# EAGLE design damp (EAGLE 7.1.0)
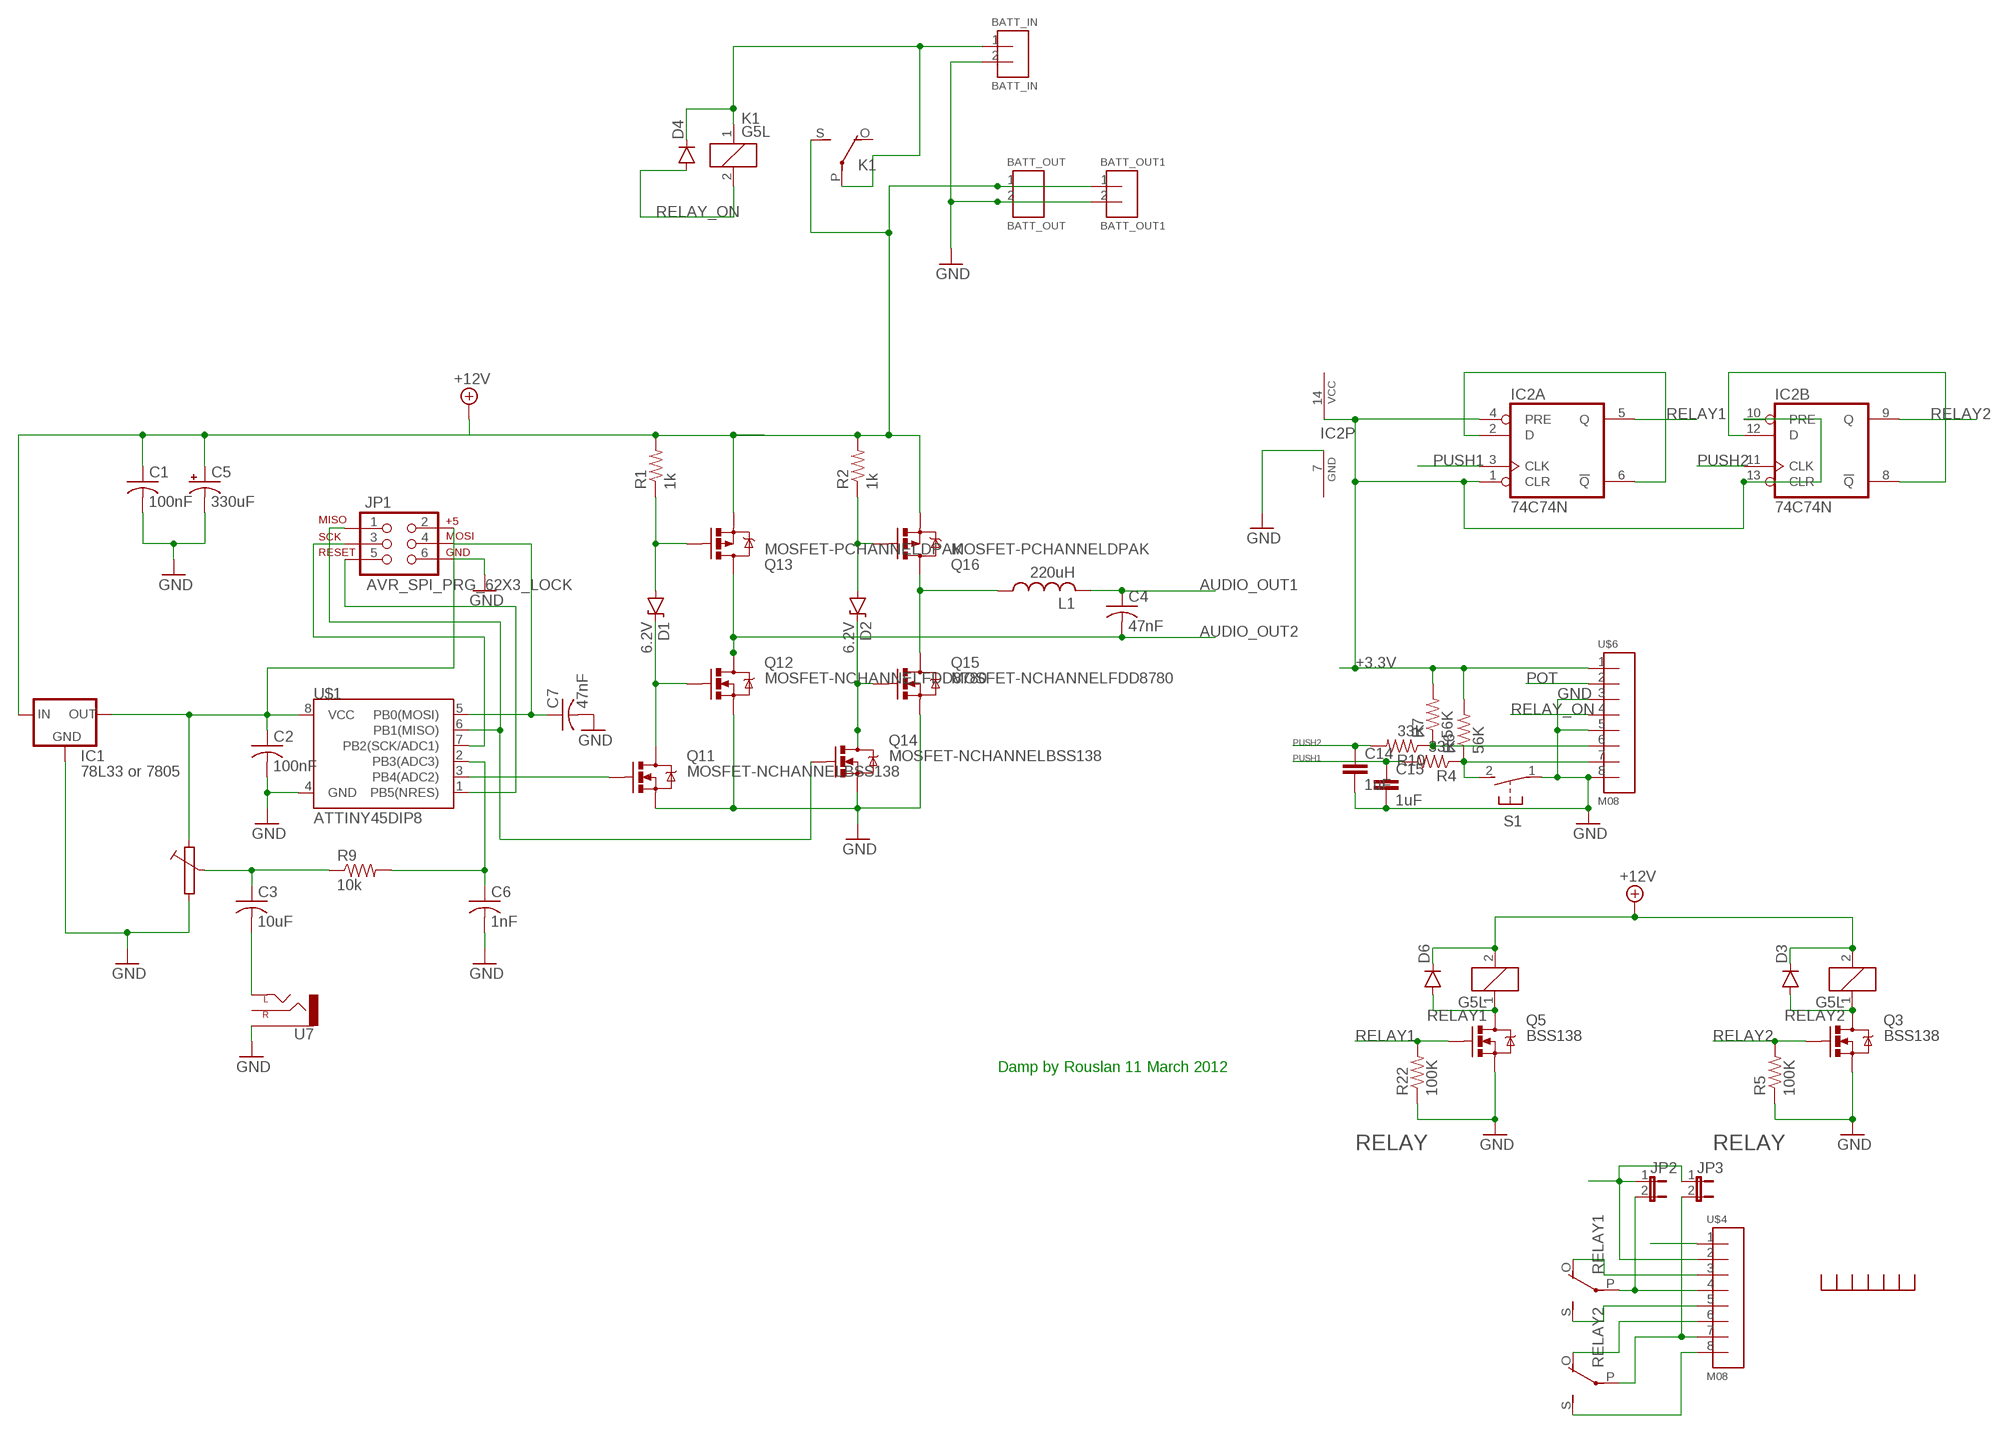
[diagram p0: schematic, sheet 1]

## Parts
BATT_IN  BATT_IN  M02PLUG  [PLUG_02]
BATT_OUT  BATT_OUT  M02PLUG  [PLUG_02]
BATT_OUT1  BATT_OUT1  M02PLUG  [PLUG_02]
C1  100nF  C-USC0603  [C0603]
C2  100nF  C-USC0603  [C0603]
C3  10uF  C-USC1206  [C1206]
C4  47nF  C-USC0603  [C0603]
C5  330uF  CPOL-USTT6D6  [TT5D6]
C6  1nF  C-USC0603  [C0603]
C7  47nF  C-USC0603  [C0603]
C14  1uF  C-EUC0603  [C0603]
C15  1uF  C-EUC0603  [C0603]
D1  6.2V  DIODE-ZENER3.3V  [SOD-323]
D2  6.2V  DIODE-ZENER3.3V  [SOD-323]
D3  DIODESMA-ALT  [SMA-DIODE_ALT]
D4  DIODESMA-ALT  [SMA-DIODE_ALT]
D6  DIODESMA-ALT  [SMA-DIODE_ALT]
IC1  78L33 or 7805  V_REG_78XXTO-92  [TO-92]
IC2  74C74N  74LS74N  [DIL14]
JP1  AVR_SPI_PRG_62X3_LOCK  [2X3_LOCK]
JP2  JP1E  [JP1]
JP3  JP1E  [JP1]
K1  G5L  [G5LE]
L1  220uH  L-USPIS2816  [PIS2816]
Q3  BSS138  MOSFET-NCHANNELBSS138  [SOT23-3]
Q5  BSS138  MOSFET-NCHANNELBSS138  [SOT23-3]
Q11  MOSFET-NCHANNELBSS138  [SOT23-3]
Q12  MOSFET-NCHANNELFDD8780  [DPAK]
Q13  MOSFET-PCHANNELDPAK  [DPAK]
Q14  MOSFET-NCHANNELBSS138  [SOT23-3]
Q15  MOSFET-NCHANNELFDD8780  [DPAK]
Q16  MOSFET-PCHANNELDPAK  [DPAK]
R1  1k  R-US_R0603  [R0603]
R2  1k  R-US_R0603  [R0603]
R4  33K  RESISTOR0603-RES  [0603-RES]
R5  100K  RESISTOR0603-RES  [0603-RES]
R6  56K  RESISTOR0603-RES  [0603-RES]
R7  56K  RESISTOR0603-RES  [0603-RES]
R9  10k  R-US_R0603  [R0603]
R10  33K  RESISTOR0603-RES  [0603-RES]
R22  100K  RESISTOR0603-RES  [0603-RES]
RELAY1  G5L  [G5LE]
RELAY2  G5L  [G5LE]
S1  31-XX  [B3F-31XX]
U7  AUDIO-JACKPTH  [AUDIO-JACK]
U$1  ATTINY45DIP8  [DIP08]
U$4  M08  [PLUG_08]
U$5  RADIATEUR  [RADIATEUR_577102B00000G]
U$6  M08  [PLUG_08]

## Nets
+3.3V: C2.1 IC1.3(OUT) IC2.1(A:CLR) IC2.4(A:PRE) IC2.10(B:PRE) IC2.13(B:CLR) JP1.2 R6.2 R7.2 U$1.8(VCC) U$6.1
+12V [5V]: BATT_OUT1.1 BATT_OUT.1 C1.1 C5.+ D3.C D6.C IC1.2(IN) K1.S(2:S) Q13.3(S) Q16.3(S) R1.2 R2.2 RELAY1.2 RELAY2.2
AUDIO_1: L1.1 Q15.4(D) Q16.4(D)
AUDIO_OUT1: C4.1 JP2.1 JP3.1 L1.2 U$4.2
AUDIO_OUT2: C4.2 Q12.4(D) Q13.4(D) U$4.1
GND: BATT_IN.2 BATT_OUT1.2 BATT_OUT.2 C1.2 C2.2 C5.- C6.2 C7.2 C14.2 C15.2 IC1.1(GND) JP1.6 Q3.2(S) Q5.2(S) Q11.2(S) Q12.3(S) Q14.2(S) Q15.3(S) R5.1 R22.1 S1.1(P) U7.SLEEVE U$1.4(GND) U$6.3 U$6.5 U$6.8
N$1: D1.A Q13.1(G) R1.1
N$2: D2.A Q16.1(G) R2.1
N$3: JP2.2 RELAY1.P(2:P) U$4.4
N$4: JP1.5 U$1.1(PB5(NRES))
N$7: D1.C Q11.3(D) Q12.1(G)
N$8: D2.C Q14.3(D) Q15.1(G)
N$10: C6.1 R9.2 U$1.2(PB3(ADC3))
N$11: C7.1 JP1.4 U$1.5(PB0(MOSI))
N$12: RELAY1.O(2:O) U$4.3
N$13: JP1.1 Q14.1(G) U$1.6(PB1(MISO))
N$14: JP1.3 U$1.7(PB2(SCK/ADC1))
N$15: RELAY1.S(2:S) U$4.5
N$16: RELAY2.O(2:O) U$4.6
N$17: RELAY2.S(2:S) U$4.8
N$18: Q11.1(G) U$1.3(PB4(ADC2))
N$19: D6.A Q5.3(D) RELAY1.1
N$20: R7.1 R10.1 U$6.6
N$21: JP3.2 RELAY2.P(2:P) U$4.7
N$22: R4.1 R6.1 S1.2(S) U$6.7
N$23: C3.2 U7.TIP(LEFT)
N$26: D3.A Q3.3(D) RELAY2.1
N$28: BATT_IN.1 D4.C K1.1 K1.P(2:P)
N$29: IC2.2(A:D) IC2.6(A:!Q)
N$32: IC2.8(B:!Q) IC2.12(B:D)
POT: C3.1 R9.1 U$6.2
PUSH1: C15.1 IC2.3(A:CLK) R4.2
PUSH2: C14.1 IC2.11(B:CLK) R10.2
RELAY1: IC2.5(A:Q) Q5.1(G) R22.2
RELAY2: IC2.9(B:Q) Q3.1(G) R5.2
RELAY_ON: D4.A K1.2 U$6.4
Unconnected: K1.O(2:O) U7.RING(RIGHT)

## Notes on the sheet
- Damp by Rouslan 11 March 2012
- RELAY | RELAY

## Power pins joined to a net without a drawn wire
GND: IC2.7(P:GND)
VCC: IC2.14(P:VCC)

## Library data of the parts
BATT_IN BATT_OUT BATT_OUT1 = pierre_vv:M02
C1-C4 C6 C7 = rcl:C-US: CAPACITOR, American symbol
C5 = rcl:CPOL-US: POLARIZED CAPACITOR, American symbol
C14 C15 = rcl:C-EU: CAPACITOR, European symbol
D1 D2 = SparkFun-DiscreteSemi:DIODE-ZENER: Zener Diode Production Part - 8199 3.4V Zener Voltage; PROD_ID: DIO-11284; VALUE: 3.3V
D3 D4 D6 = SparkFun-DiscreteSemi:DIODE: Diode These are standard reverse protection diodes and small signal diodes. SMA package can handle up to about 1A. SOD-323 can handle about 200mA. What the SOD-323 package when ordering, there are some mfgs out there that are 5-pin packages.
IC1 = SparkFun:V_REG_78XX: Voltage Regulator Standard 7805 5V regulator. IGO (Input Ground Output). Spark Fun Electronics SKU : COM-00107
IC2 = 74xx-us:74*74: Dual D type positive edge triggered FLIP FLOP, preset and clear
JP1 = SparkFun:AVR_SPI_PRG_6: AVR ISP 6 Pin This is the reduced ISP connector for AVR programming. Common on Arduino. This footprint will take up less PCB space and can be used with a 10-pin to 6-pin adapter such as SKU: BOB-08508
JP2 JP3 = jumper:JP1E: JUMPER
K1 RELAY1 RELAY2 = relay:G5L: RELAY 1 x switch, 10 A/120 V AC, 8 A/30 V ADC, Omron; OC_FARNELL: unknown; OC_NEWARK: unknown
L1 = rcl:L-US: INDUCTOR, American symbol
Q3 Q5 Q11 Q14 = SparkFun-DiscreteSemi:MOSFET-NCHANNEL: Common NMOSFET Parts MFG P/N Store ID Prod ID FDD8780 TRANS-09984 SI7820DN TRANS-11055 FDS6630A IC-08089 2N7002PW TRANS-11151 FQP30N06L COM-10213 TRANS-10060 BSS123LT1G TRANS-08345 BSS138 TRANS-00830 BS170 2N7000; PROD_ID: TRANS-00830
Q12 Q15 = SparkFun-DiscreteSemi:MOSFET-NCHANNEL: Common NMOSFET Parts MFG P/N Store ID Prod ID FDD8780 TRANS-09984 SI7820DN TRANS-11055 FDS6630A IC-08089 2N7002PW TRANS-11151 FQP30N06L COM-10213 TRANS-10060 BSS123LT1G TRANS-08345 BSS138 TRANS-00830 BS170 2N7000; PROD_ID: TRANS-09984
Q13 Q16 = SparkFun-DiscreteSemi:MOSFET-PCHANNEL: Generic PMOSFET IRLML2244 - TRANS-11153 (SOT-23 -20V -4.3A) (1.Gate 2.Source 3.Drain) FQP27P06 - COM-10349 <http://www.sparkfun.com/products/10349> (TO-220 -60V -27A) (1.Gate 2.Source 3.Drain)
R1 R2 R9 = rcl:R-US_: RESISTOR, American symbol
R4-R7 R10 R22 = SparkFun-Passives:RESISTOR: Resistor Basic schematic elements and footprints for 0603, 1206, and PTH resistors.
S1 = switch-omron:31-XX: OMRON SWITCH; MPN: B3F-3100; OC_FARNELL: 959704; OC_NEWARK: 36M3582
U7 = SparkFun:AUDIO-JACK: 3.5mm Audio Jack Simple 3.5mm common PCB mount audio jack. SKU: PRT-08032
U$1 = SparkFun:ATTINY45: Atmel ATTiny45
U$4 U$6 = pierre_vv:M08
U$5 = pierre_vv:RADIATEUR

## Net classes
0 default: width 0.203 mm
1 GND: width 0.254 mm
3 5V: width 0.305 mm
4 230AC: width 0.61 mm, clearance 0.305 mm

## Board
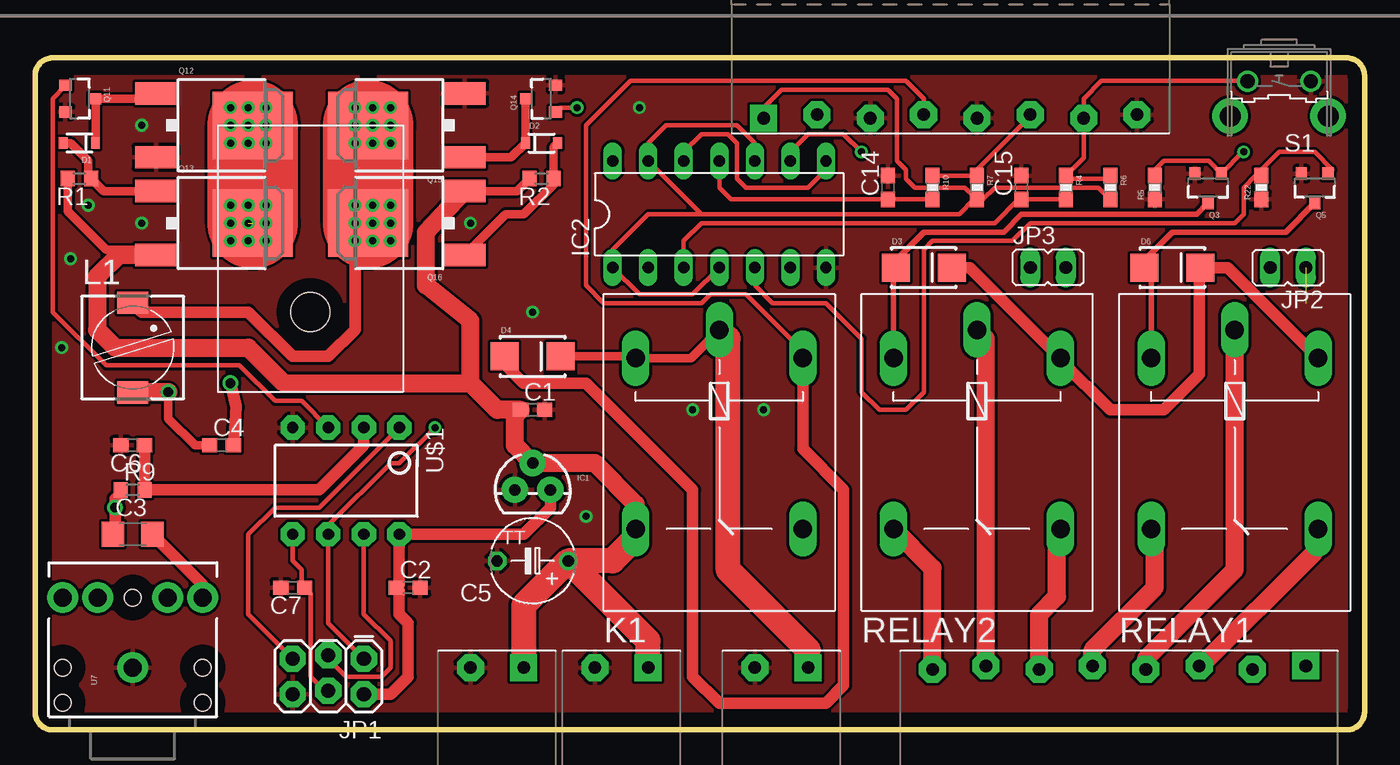
[diagram p1: board, top side]
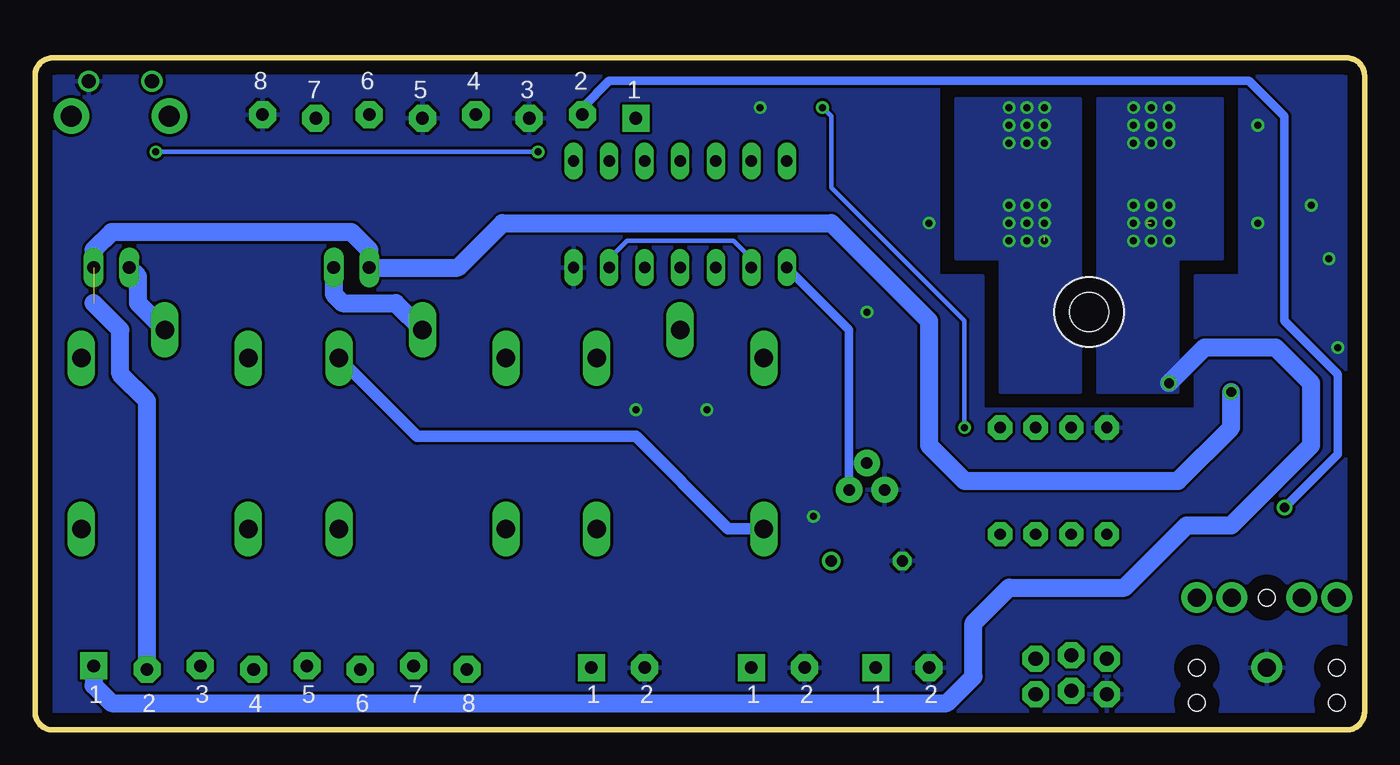
[diagram p2: board, bottom side, seen from below]

Size 95 x 48 mm. Coordinates in mm from the lower left corner, seen from the top.
Outline: 93.73,0 1.27,0 arc-90 0,1.27 0,46.73 arc-90 1.27,48 93.73,48 arc-90 95,46.73 95,1.27 arc-90 93.73,0
Copper layers (1*16): Top 0.035mm / dielectric 1.5mm / Bottom 0.035mm
Design rules "default": minimum track width 10mil, minimum drill 24mil, track to track 8mil, track to pad 8mil, pad to pad 8mil, via to via 8mil, smd to smd 8mil, copper to edge 40mil, drill to drill 8mil, minimum pad ring 10mil, minimum via ring 8mil, stop-mask expansion 4mil, vias tented up to drill 0mil, thermal gap 10mil

### Footprints (pad centres in the part's own frame; a part is rotated, then mirrored left to right if it is on the bottom)
PLUG_02 = drill 0.9 pad 1.93 square: 1 -1.905,0 | drill 0.9 pad 1.93 octagon: 2 1.905,0
C0603 = smd 1.1 x 1: 1 -0.85,0; 2 0.85,0
C1206 = smd 1.6 x 1.8: 1 -1.4,0; 2 1.4,0
TT5D6 = drill 0.813: + -2.54,0 | drill 0.813 octagon: - 2.54,0
SOD-323 = smd 0.63 x 0.83: A 1.15,0; C -1.15,0
SMA-DIODE_ALT = smd 2 x 2: A -2,0; C 2,0
TO-92 = drill 0.813 pad 1.88: 1 -1.27,0; 2 0,1.905; 3 1.27,0
DIL14 = drill 0.813 long: 1 -7.62,-3.81; 2 -5.08,-3.81; 3 -2.54,-3.81; 4 0,-3.81; 5 2.54,-3.81; 6 5.08,-3.81; 7 7.62,-3.81; 8 7.62,3.81; 9 5.08,3.81; 10 2.54,3.81; 11 0,3.81; 12 -2.54,3.81; 13 -5.08,3.81; 14 -7.62,3.81
2X3_LOCK = drill 1.016 pad 1.88 octagon: 1 0,0; 2 0,2.54; 3 2.54,-0.254; 4 2.54,2.286; 5 5.08,0; 6 5.08,2.54
JP1 = drill 0.914 long: 1 0,-1.27; 2 0,1.27
G5LE = drill 1.321 long: 1 -7.493,-5.969; 2 -7.493,5.969; O 4.699,5.969; P -9.525,0; S 4.699,-5.969
PIS2816 = smd 2.2 x 1.6: 1 0,3.2; 2 0,-3.2
SOT23-3 = smd 0.8 x 0.9: 1 -0.95,-1; 2 0.95,-1; 3 0,1.1
DPAK = smd 1.6 x 3: 1 -2.28,-5.31; 3 2.28,-5.31 | smd 4.826 x 5.715: 4 0,1.588
R0603 = smd 1 x 1.1: 1 -0.85,0; 2 0.85,0
0603-RES = smd 1.1 x 1: 1 -0.85,0; 2 0.85,0
B3F-31XX = drill 1.016: 1 -2.261,-1.245; 2 2.261,-1.245 | drill 1.499 pad 2.54: 3 -3.505,1.245; 4 3.505,1.245
AUDIO-JACK = drill 1.3 pad 2.184: RING 5,5; RSH 5,2.5; SLEEVE 0,0; TIP 5,-5; TSH 5,-2.5 | hole 1.2: 0,5; -2.5,5; -2.5,-5; 0,-5; 5,0
DIP08 = drill 0.813 pad 1.727 octagon: 1 -3.81,-3.81; 2 -1.27,-3.81; 3 1.27,-3.81; 4 3.81,-3.81; 5 3.81,3.81; 6 1.27,3.81; 7 -1.27,3.81; 8 -3.81,3.81
PLUG_08 = drill 0.9 pad 1.93 square: 1 -13.335,-0.127 | drill 0.9 pad 1.93 octagon: 2 -9.525,0.127; 3 -5.715,-0.127; 4 -1.905,0.127; 5 1.905,-0.127; 6 5.715,0.127; 7 9.525,-0.127; 8 13.335,0.127
RADIATEUR_577102B00000G = hole 2.8: 0,0

### Placement (x,y rotation side)
BATT_IN  53.34,4.45 180 top
BATT_OUT  33.02,4.45 180 top
BATT_OUT1  41.91,4.45 180 top
C1  35.56,22.86 0 top
C2  26.67,10.16 0 top
C3  6.99,13.97 0 top
C4  13.34,20.32 0 top
C5  35.56,12.06 180 top
C6  6.99,20.32 180 top
C7  18.41,10.16 180 top
C14  60.96,38.73 90 top
C15  70.48,38.73 90 top
D1  3.17,41.91 180 top
D2  36.2,41.91 0 top
D3  63.5,33.02 0 top
D4  35.56,26.67 0 top
D6  81.28,33.02 0 top
IC1  35.56,17.14 0 top
IC2  48.9,36.83 0 top
JP1  23.5,5.08 180 top
JP2  89.53,33.02 90 top
JP3  72.39,33.02 270 top
K1  48.9,19.05 270 top
L1  6.99,27.3 0 top
Q3  83.82,38.73 180 top
Q5  91.44,38.73 180 top
Q11  3.17,45.09 270 top
Q12  13.97,43.18 270 top
Q13  13.97,36.2 270 top
Q14  36.2,45.09 90 top
Q15  25.4,43.18 90 top
Q16  25.4,36.2 90 top
R1  3.17,39.37 180 top
R2  36.2,39.37 180 top
R4  73.66,38.73 270 top
R5  80.01,38.73 90 top
R6  76.83,38.73 270 top
R7  67.31,38.73 270 top
R9  6.99,17.14 0 top
R10  64.14,38.73 270 top
R22  87.63,38.73 90 top
RELAY1  85.72,19.05 270 top
RELAY2  67.31,19.05 270 top
S1  88.9,45.09 180 top
U7  6.99,4.45 90 top
U$1  22.23,17.78 180 top
U$4  77.47,4.45 180 top
U$5  19.68,29.84 270 top
U$6  65.41,43.81 0 top

### Tracks (layer width: path | path; a pad name or v marks a point on that pad's centre or on a via)
+3.3V
  Top 0.305: U$6.1 52.07,44.45 53.34,45.72 60.96,45.72 61.59,45.09 61.59,40.64 62.23,40.01 62.23,39.37 62.87,38.73 66.46,38.73 67.09,38.1 67.09,37.88 | R6.2 75.98,38.73 68.58,38.73 67.73,37.88 R7.2 67.09,37.88 | IC2.10 51.44,41.91 50.16,43.18 45.09,43.18 43.81,41.91 IC2.13 47.62,36.83 | 67.09,37.88 66.04,36.83 47.62,36.83 | 47.62,36.83 43.81,36.83 41.27,34.29 IC2.1 43.18,31.11 46.99,31.11 IC2.4
  Top 0.813: IC1.3 36.83,15.88 34.92,13.97 U$1.8 26.04,10.38 C2.1 26.04,9.95 26.04,8.26 26.67,7.62 26.67,3.81 25.4,2.54 JP1.2
  Bottom 0.61: IC1.3 36.83,28.57 IC2.1
+12V
  Top 0.406: RELAY2.2 73.28,26.42 | 83.19,32.92 D6.C
  Top 0.61: R1.2 2.33,37.05 5.08,34.29 8.29,34.29 Q13.3 | Q16.3 34.45,38.48 R2.2
  Top 0.813: D6.C 85.22,33.02 RELAY1.2 | 73.28,26.42 76.83,22.86 80.64,22.86 83.19,25.4 83.19,32.92 | D3.C 66.8,33.02 RELAY2.2
  Top 1.27: 31.11,24.77 31.11,29.21 27.94,31.75 27.94,35.53 Q16.3 | Q13.3 5.97,33.91 4.45,32.38 4.45,28.57 5.71,27.3 15.24,27.3 17.78,24.77 31.11,24.77 | 31.11,24.77 33.02,22.86 C1.1 34.29,22.44 34.29,20.32 IC1.2 40.01,19.05 42.93,16.13 K1.S
  Top 1.778: K1.S 42.93,13.72 41.27,12.06 C5.+ | C5.+ 34.92,8.89 BATT_OUT.1 | BATT_OUT1.1 43.81,6.35 C5.+
  Bottom 0.813: K1.S 45.47,14.35 52.07,20.95 67.69,20.95 RELAY2.2
AUDIO_1  (via drill 0.5)  (1 unrouted)
  Top 0.813: L1.1 6.99,30.48 7.62,29.84 15.24,29.84 18.41,26.67 20.95,26.67 22.86,28.57 22.86,35.24 Q16.4
  Top 6.452: Q16.4 Q15.4
  other vias: 22.86,44.45 24.13,44.45 25.4,44.45 25.4,43.18 24.13,43.18 22.86,43.18 22.86,41.91 24.13,41.91 25.4,41.91 25.4,37.47 24.13,37.47 22.86,37.47 22.86,36.2 24.13,36.2 25.4,36.2 25.4,34.92 24.13,34.92 22.86,34.92
  pour Bottom: 20.32,45.09 29.21,45.09 29.21,33.66 26.04,33.66 26.04,24.13 20.32,24.13
AUDIO_OUT1  (via drill 0.7)  (1 unrouted)
  Top 0.61: C4.1 11.43,20.32 9.53,22.23 v9.53,24.13
  Top 1.27: v9.53,24.13 8.28,24.13 L1.2
  Bottom 1.27: JP2.1 90.81,34.29 89.53,35.56 72.39,35.56 71.12,34.29 JP3.1 64.77,33.02 61.59,36.2 38.1,36.2 31.11,29.21 31.11,20.32 28.57,17.78 13.34,17.78 9.53,21.59 v9.53,24.13 | U$4.2 87,23.5 88.9,25.4 88.9,28.57 90.81,30.48
AUDIO_OUT2  (via drill 0.5, 0.7)  (1 unrouted)
  Top 0.813: C4.2 14.39,23.07 v13.97,24.77
  Top 6.452: Q13.4 Q12.4
  Bottom 1.27: U$4.1 90.81,3.17 89.53,1.91 29.84,1.91 27.94,3.81 27.94,7.62 25.4,10.16 17.14,10.16 12.7,14.61 9.53,14.61 3.81,20.32 3.81,24.77 6.35,27.3 11.43,27.3 v13.97,24.77
  other vias: 13.97,44.45 15.24,44.45 16.51,44.45 16.51,43.18 15.24,43.18 13.97,43.18 13.97,41.91 15.24,41.91 16.51,41.91 13.97,37.47 15.24,37.47 16.51,37.47 16.51,36.2 15.24,36.2 15.24,34.92 16.51,34.92 13.97,34.92 13.97,36.2
  pour Bottom: 10.16,45.09 19.05,45.09 19.05,24.13 13.34,24.13 13.34,33.66 10.16,33.66
GND  (via drill 0.5)
  other vias: 2.54,33.66 43.18,44.45 46.99,22.86 52.07,22.86 35.56,29.84 39.37,15.24 7.62,36.2 7.62,43.18 1.91,27.3 3.81,37.47 31.11,36.2
  pour Top: -3.81,52.07 99.06,52.07 99.06,-3.81 -3.81,-3.81
  pour Bottom: -0.64,48.9 8.89,48.9 8.89,32.38 12.06,32.38 12.06,22.86 27.3,22.86 27.3,32.38 30.48,32.38 30.48,47.62 9.53,47.62 9.53,48.9 95.89,48.9 95.89,-0.64 -0.64,-0.64
N$1
  Top 0.61: Q13.1 4.92,38.48 R1.1 3.81,39.59 3.81,40.64 2.54,41.91 D1.A
N$2
  Top 0.61: D2.A 37.05,41.61 R2.1 37.05,38.95 34.92,36.83 33.62,36.83 Q16.1
N$3
  Top 1.27: U$4.4 79.38,5.08 85.72,11.43 RELAY1.P
  Bottom 1.27: RELAY1.P 87.63,30.48 87.63,32.38 JP2.2
N$4
  Top 0.305: U$1.1 20.32,15.88 17.14,15.88 15.24,13.97 15.24,8.26 JP1.5
N$7
  Top 0.61: Q12.1 8.29,45.09 Q11.3 4.33,45.03 D1.C
N$8
  Top 0.61: Q15.1 34.03,40.9 D2.C 35.05,45.03 Q14.3
N$10
  Top 0.813: C6.1 R9.2 20.32,17.14 23.5,20.32 U$1.2
N$11
  Top 0.305: U$1.5 18.41,12.06 19.05,11.43 19.05,10.38 C7.1 19.68,9.74 19.68,3.81 20.7,2.79 JP1.4
N$12
  Top 1.27: U$4.3 83.31,4.57 91.44,12.7 91.44,14.1 RELAY1.O
N$13  (via drill 0.5)
  Top 0.305: JP1.1 20.95,7.62 U$1.6 20.95,14.61 25.4,19.05 26.04,19.05 v28.57,21.59 | v38.73,44.45 37.51,44.45 Q14.1
  Bottom 0.305: v28.57,21.59 28.57,29.21 38.1,38.73 38.1,43.81 v38.73,44.45
N$14
  Top 0.305: JP1.3 20.95,5.08 22.23,3.81 24.77,3.81 25.4,4.45 25.4,6.35 23.5,8.26 U$1.7
N$15
  Top 1.27: U$4.5 75.56,5.71 80.01,10.16 80.01,14.1 RELAY1.S
N$16
  Top 1.27: U$4.6 71.75,8.26 73.03,9.53 73.03,14.1 RELAY2.O
N$17
  Top 1.27: U$4.8 64.14,11.56 RELAY2.S
N$18
  Top 0.305: Q11.1 2.17,45.99 1.27,45.09 1.27,29.84 5.08,26.04 14.61,26.04 17.14,23.5 19.05,23.5 U$1.3
N$19
  Top 0.406: Q5.3 89.36,35.56 81.28,35.56 79.28,33.56 D6.A 79.76,32.54 RELAY1.1
N$20
  Top 0.305: R10.1 R7.1 67.31,40.01 71.12,43.81 U$6.6
N$21
  Top 1.27: U$4.7 67.94,27.94 RELAY2.P
  Bottom 1.27: JP3.2 73.66,31.11 73.03,30.48 69.22,30.48 RELAY2.P
N$22
  Top 0.305: R6.1 76.83,39.37 73.88,39.37 R4.1 74.93,40.85 U$6.7 74.93,45.09 76.2,46.35 86.61,46.35 S1.2
N$23
  Top 0.813: U7.TIP 11.98,10.37 C3.2
N$26
  Top 0.406: RELAY2.1 61.34,32.86 D3.A 61.5,33.56 63.5,35.56 69.22,35.56 70.48,36.83 83.02,36.83 Q3.3
N$28
  Top 0.61: D4.C 42.8,26.67 K1.1 46.86,26.54 K1.P
  Top 1.778: BATT_IN.1 55.24,5.71 49.53,11.43 49.53,27.94 K1.P
N$29
  Bottom 0.305: IC2.2 43.81,33.66 45.09,34.92 52.7,34.92 53.98,33.66 IC2.6
N$32
  Top 0.305: IC2.12 46.35,41.27 47.62,42.55 49.53,42.55 50.16,41.91 50.16,39.37 50.8,38.73 55.24,38.73 56.52,40.01 IC2.8
POT  (via drill 0.7)
  Top 0.813: R9.1 6.13,16.93 5.71,16.51 v5.71,15.88 5.71,14.1 C3.1
  Bottom 0.61: U$6.2 55.88,44.45 53.98,46.35 8.26,46.35 5.71,43.81 5.71,29.21 1.91,25.4 1.91,19.68 v5.71,15.88
PUSH1
  Top 0.305: R4.2 C15.1 70.27,37.88 68.58,36.2 47.62,36.2 46.35,34.92 IC2.3
PUSH2
  Top 0.305: R10.2 C14.1 49.74,37.88 48.9,38.73 IC2.11
RELAY1
  Top 0.305: Q5.1 92.66,40.01 92.71,40.01 91.44,41.27 88.9,41.27 87.63,40.01 R22.2 87.21,39.59 86.36,38.73 86.36,36.83 85.72,36.2 71.12,36.2 69.85,34.92 64.14,34.92 63.5,34.29 63.5,24.13 62.23,22.86 60.33,22.86 59.05,24.13 59.05,27.94 56.52,30.48 52.7,30.48 51.44,31.75 IC2.5
RELAY2  (via drill 0.5)
  Top 0.305: R5.2 80.01,40.01 80.64,40.64 83.86,40.64 Q3.1 86.31,41.27 v86.36,41.27 | IC2.9 53.98,41.27 55.24,42.55 57.78,42.55 v59.05,41.27
  Bottom 0.305: v59.05,41.27 v86.36,41.27
RELAY_ON
  Top 0.305: K1.2 54.86,27.05 50.8,31.11 48.26,31.11 47.62,30.48 40.64,30.48 39.37,31.75 39.37,43.18 42.55,46.35 62.23,46.35 63.5,45.09 U$6.4
  Top 0.813: K1.2 54.86,20.07 57.78,17.14 57.78,3.17 56.52,1.91 48.9,1.91 46.99,3.81 46.99,17.14 39.37,24.77 34.92,24.77 33.02,26.67 D4.A